# EAGLE design 714_breakout_arduino_spi (EAGLE 9.6.2)
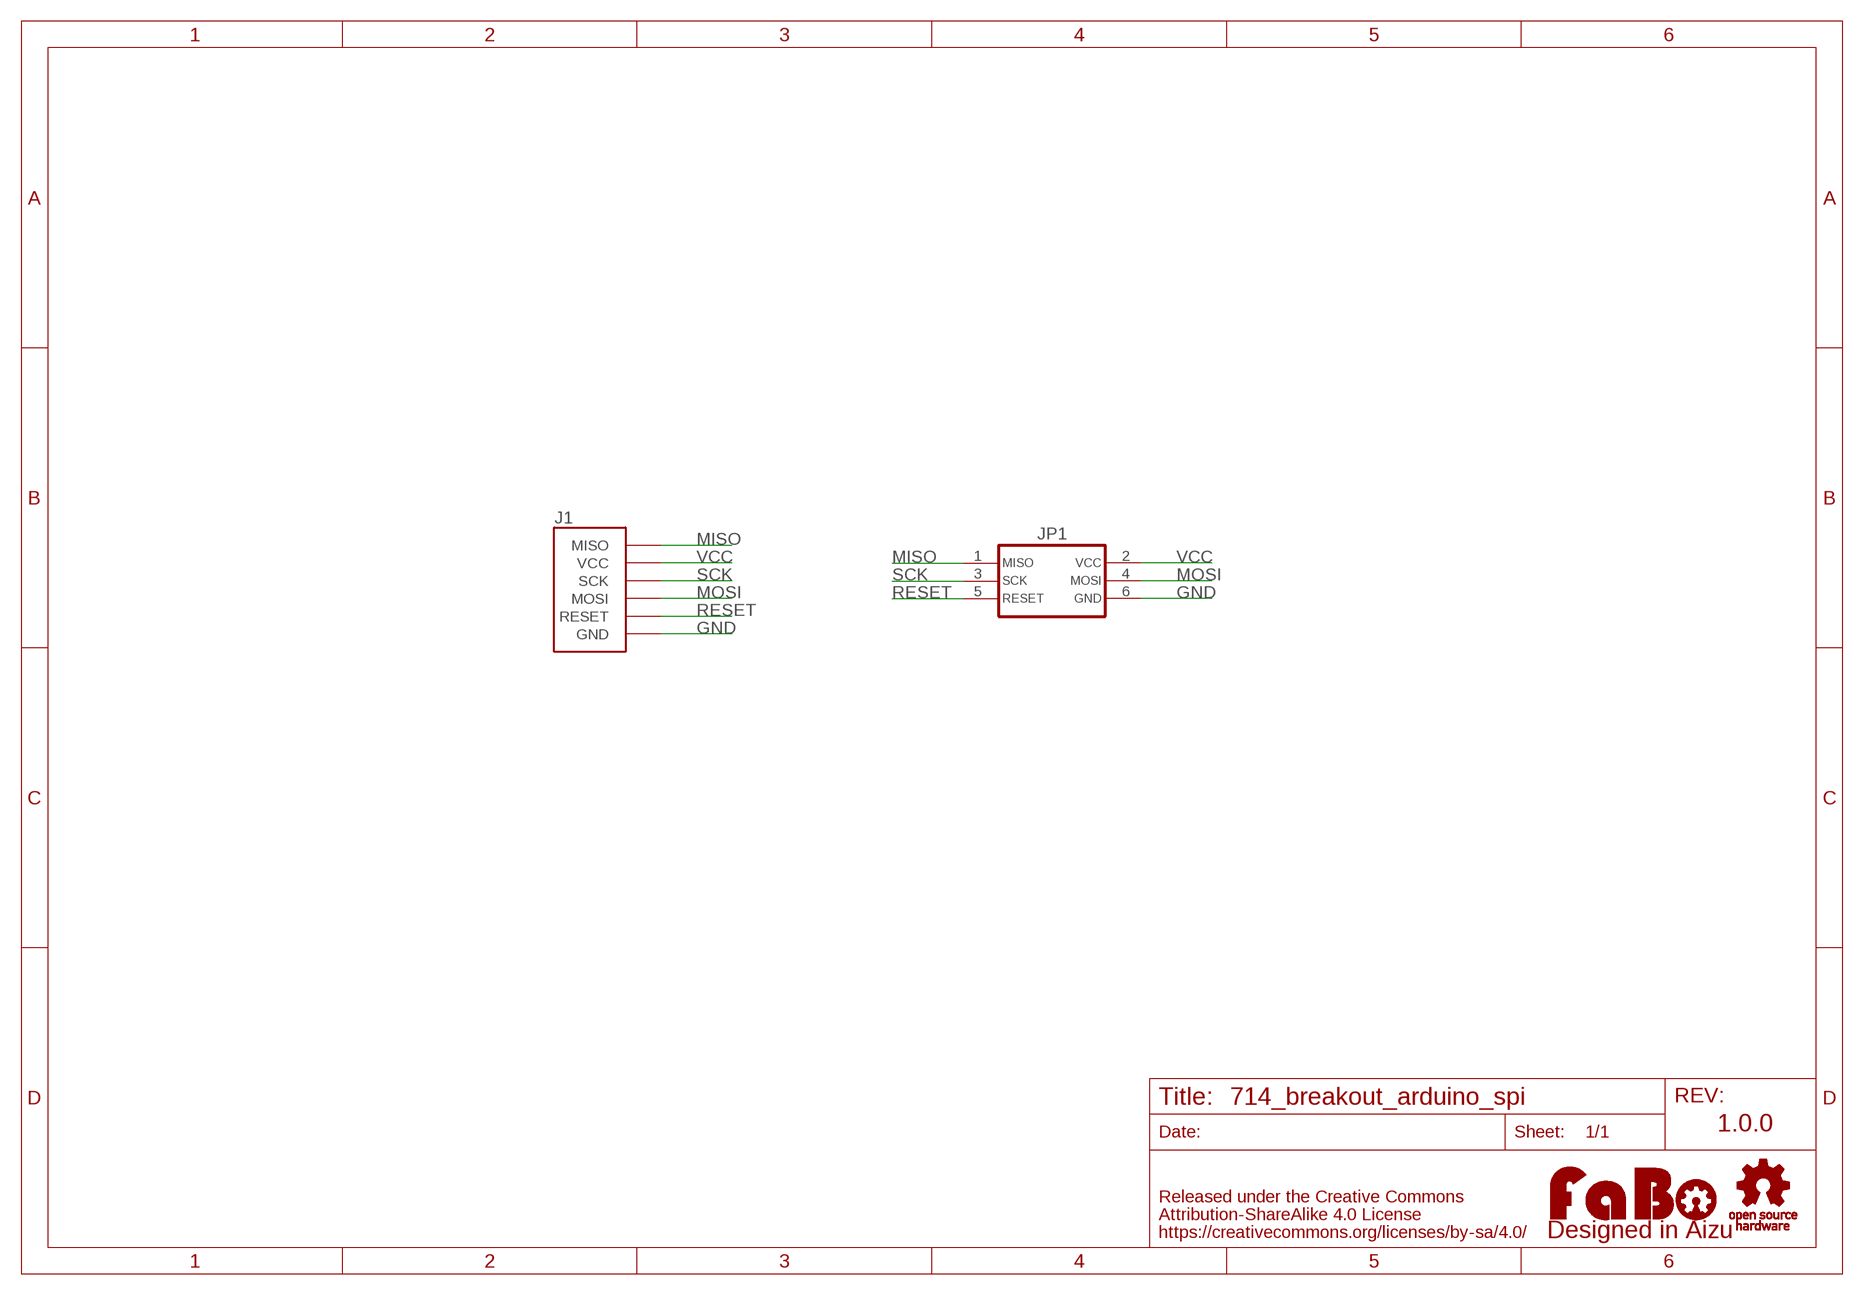
[diagram p0: schematic, sheet 1]

## Parts
J1  FABO_BREAKOUT_ARDUINO_SPI  [FABO_BREAKOUT_ARDUINO_SPI]
JP1  AVR_ISP-PTH  [PIN_2X3]
U$2  LOGO_OSHW-M_BOTTOM  [LOGO_OSHW_M_BOTTOM]
U$3  LOGO_FABO-M_BOTTOM  [LOGO_FABO_MS_BOTTOM]

## Nets
GND: J1.GND JP1.6
MISO: J1.MISO JP1.1
MOSI: J1.MOSI JP1.4
RESET: J1.RESET JP1.5
SCK: J1.SCK JP1.3
VCC: J1.VCC JP1.2

## Notes on the sheet
- 1.0.0

## Library data of the parts
J1 = FaBo-Template:FABO_BREAKOUT_ARDUINO_SPI
JP1 = FaBo-PIN:AVR_ISP
U$2 = FaBo-etc:LOGO_OSHW
U$3 = FaBo-Logo:LOGO_FABO

## Board
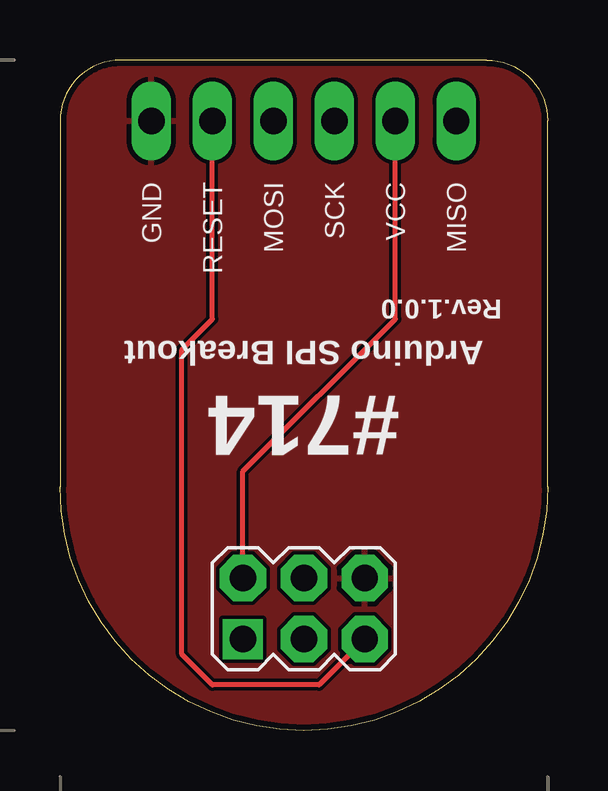
[diagram p1: board, top side]
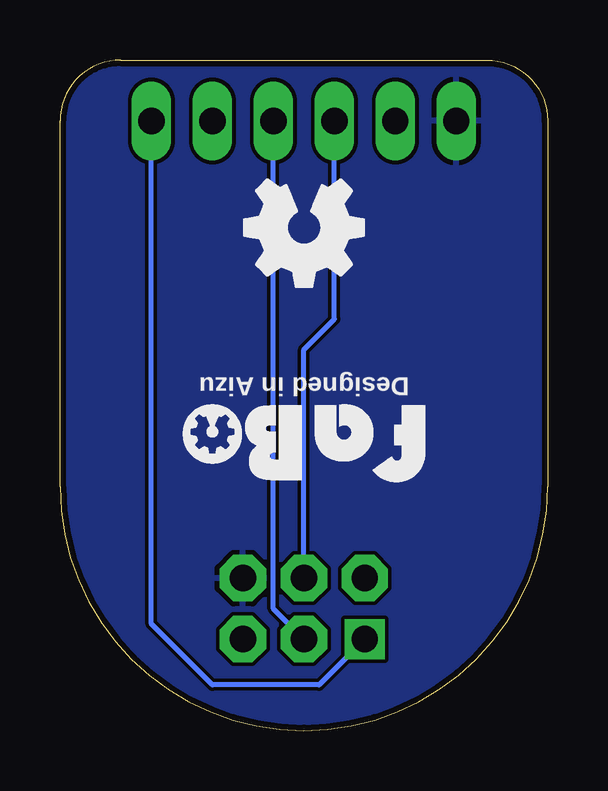
[diagram p2: board, bottom side, seen from below]

Size 20.32 x 27.94 mm. Coordinates in mm from the lower left corner, seen from the top.
Copper layers (1*16): Top 0.035mm / dielectric 1.6mm / Bottom 0.035mm
Design rules "PCBway": minimum track width 6mil, minimum drill 12mil, track to track 6mil, track to pad 6mil, pad to pad 6mil, via to via 6mil, smd to smd 6mil, copper to edge 10mil, drill to drill 10mil, minimum pad ring 10mil, minimum via ring 6mil, stop-mask expansion 2mil, vias tented up to drill 100mil, thermal gap 8mil

### Footprints (pad centres in the part's own frame; a part is rotated, then mirrored left to right if it is on the bottom)
FABO_BREAKOUT_ARDUINO_SPI = drill 1.1 long: GND 6.35,-11.43; MISO -6.35,-11.43; MOSI 1.27,-11.43; RESET 3.81,-11.43; SCK -1.27,-11.43; VCC -3.81,-11.43
PIN_2X3 = drill 1.1 pad 1.676 square: 1 -1.27,2.54 | drill 1.1 pad 1.93 octagon: 2 1.27,2.54; 3 -1.27,0; 4 1.27,0; 5 -1.27,-2.54; 6 1.27,-2.54

### Placement (x,y rotation side)
J1  10.16,13.97 180 top
JP1  10.16,5.08 90 top
U$2  10.16,20.95 180 top
U$3  10.16,13.97 180 top

### Tracks (layer width: path | path; a pad name or v marks a point on that pad's centre or on a via)
GND
  pour Bottom: 0,0 20.32,0 20.32,27.94 0,27.94
  pour Top: 0,0 20.32,0 20.32,27.94 0,27.94
MISO
  Bottom 0.203: JP1.1 9.53,1.9 13.97,1.9 16.51,4.44 J1.MISO
MOSI
  Bottom 0.203: JP1.4 10.16,15.87 8.89,17.14 J1.MOSI
RESET
  Top 0.203: JP1.5 10.79,1.9 6.35,1.9 5.08,3.17 5.08,15.87 6.35,17.14 J1.RESET
SCK
  Bottom 0.203: JP1.3 11.43,5.08 J1.SCK
VCC
  Top 0.203: JP1.2 7.62,10.79 13.97,17.14 J1.VCC

### Text on the board
tPlace: Rev.1.0.0 | Arduino SPI Breakout | #714
bPlace: Designed in Aizu